# EAGLE schematic SPU (EAGLE 9.6.2), part 2 of 2
## Sheet 8 of 8: STAMP 6
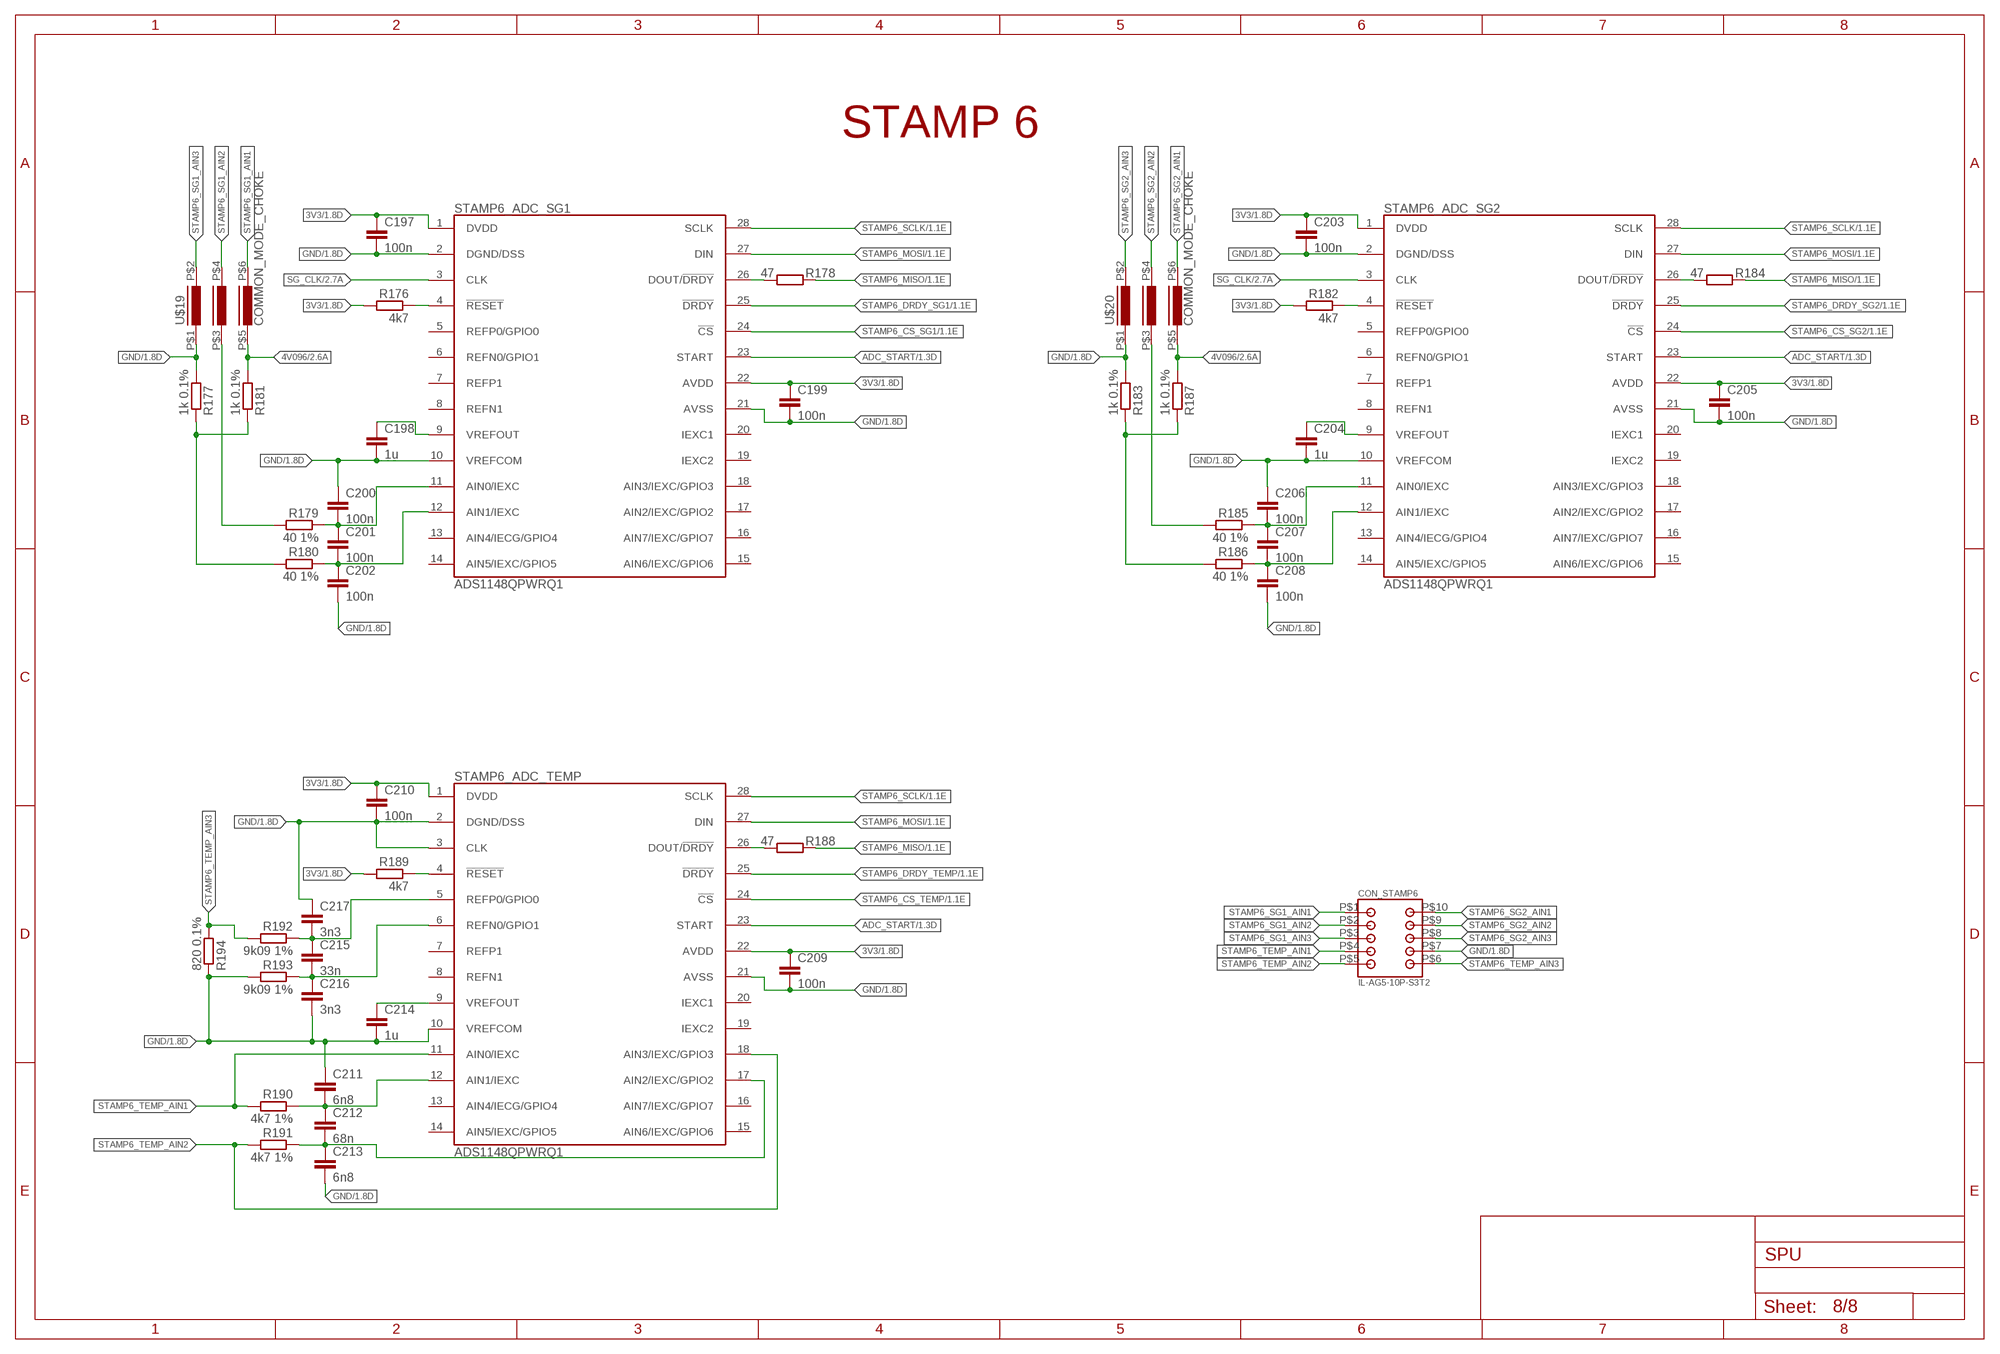
[diagram p7: schematic, sheet 8]

### Parts
C197  100n  C-EUC0805  [C0805]
C198  1u  C-EUC0805  [C0805]
C199  100n  C-EUC0805  [C0805]
C200  100n  C-EUC0805  [C0805]
C201  100n  C-EUC0805  [C0805]
C202  100n  C-EUC0805  [C0805]
C203  100n  C-EUC0805  [C0805]
C204  1u  C-EUC0805  [C0805]
C205  100n  C-EUC0805  [C0805]
C206  100n  C-EUC0805  [C0805]
C207  100n  C-EUC0805  [C0805]
C208  100n  C-EUC0805  [C0805]
C209  100n  C-EUC0805  [C0805]
C210  100n  C-EUC0805  [C0805]
C211  6n8  C-EUC0805  [C0805]
C212  68n  C-EUC0805  [C0805]
C213  6n8  C-EUC0805  [C0805]
C214  1u  C-EUC0805  [C0805]
C215  33n  C-EUC0805  [C0805]
C216  3n3  C-EUC0805  [C0805]
C217  3n3  C-EUC0805  [C0805]
CON_STAMP6  IL-AG5-10P-S3T2  [IL-AG5-10P-S3T2]
R176  4k7  R-EU_R0805  [R0805]
R177  1k 0.1%  R-EU_R0805  [R0805]
R178  47  R-EU_R0805  [R0805]
R179  40 1%  R-EU_R0805  [R0805]
R180  40 1%  R-EU_R0805  [R0805]
R181  1k 0.1%  R-EU_R0805  [R0805]
R182  4k7  R-EU_R0805  [R0805]
R183  1k 0.1%  R-EU_R0805  [R0805]
R184  47  R-EU_R0805  [R0805]
R185  40 1%  R-EU_R0805  [R0805]
R186  40 1%  R-EU_R0805  [R0805]
R187  1k 0.1%  R-EU_R0805  [R0805]
R188  47  R-EU_R0805  [R0805]
R189  4k7  R-EU_R0805  [R0805]
R190  4k7 1%  R-EU_R0805  [R0805]
R191  4k7 1%  R-EU_R0805  [R0805]
R192  9k09 1%  R-EU_R0805  [R0805]
R193  9k09 1%  R-EU_R0805  [R0805]
R194  820 0.1%  R-EU_R0805  [R0805]
STAMP6_ADC_SG1  ADS1148QPWRQ1  [TSSOP28]
STAMP6_ADC_SG2  ADS1148QPWRQ1  [TSSOP28]
STAMP6_ADC_TEMP  ADS1148QPWRQ1  [TSSOP28]
U$19  COMMON_MODE_CHOKE  [COMMON_MODE_CHOKE]
U$20  COMMON_MODE_CHOKE  [COMMON_MODE_CHOKE]

### Nets
3V3: C197.1 C199.1 C203.1 C205.1 C209.1 C210.1 R176.2 R182.2 R189.2 STAMP6_ADC_SG1.1(DVDD) STAMP6_ADC_SG1.22(AVDD) STAMP6_ADC_SG2.1(DVDD) STAMP6_ADC_SG2.22(AVDD) STAMP6_ADC_TEMP.1(DVDD) STAMP6_ADC_TEMP.22(AVDD) ; also sheet 1,2,3,4,5,6,7
4V096: R181.2 R187.2 U$19.P$5 U$20.P$5 ; also sheet 2,3,4,5,6,7
ADC_START: STAMP6_ADC_SG1.23(START) STAMP6_ADC_SG2.23(START) STAMP6_ADC_TEMP.23(START) ; also sheet 1,3,4,5,6,7
GND: C197.2 C198.2 C199.2 C200.1 C202.2 C203.2 C204.2 C205.2 C206.1 C208.2 C209.2 C210.2 C211.1 C213.2 C214.2 C216.2 C217.1 CON_STAMP6.P$7 R177.2 R183.2 R193.2 R194.1 STAMP6_ADC_SG1.2(DGND/DSS) STAMP6_ADC_SG1.10(VREFCOM) STAMP6_ADC_SG1.21(AVSS) STAMP6_ADC_SG2.2(DGND/DSS) STAMP6_ADC_SG2.10(VREFCOM) STAMP6_ADC_SG2.21(AVSS) STAMP6_ADC_TEMP.2(DGND/DSS) STAMP6_ADC_TEMP.3(CLK) STAMP6_ADC_TEMP.10(VREFCOM) STAMP6_ADC_TEMP.21(AVSS) U$19.P$1 U$20.P$1 ; also sheet 1,2,3,4,5,6,7
N$196: R176.1 STAMP6_ADC_SG1.4(!RESET)
N$197: C198.1 STAMP6_ADC_SG1.9(VREFOUT)
N$198: R178.2 STAMP6_ADC_SG1.26(DOUT/!DRDY)
N$199: C200.2 C201.1 R179.1 STAMP6_ADC_SG1.11(AIN0/IEXC)
N$200: C201.2 C202.1 R180.1 STAMP6_ADC_SG1.12(AIN1/IEXC)
N$201: R177.1 R180.2 R181.1
N$202: R179.2 U$19.P$3
N$203: R182.1 STAMP6_ADC_SG2.4(!RESET)
N$204: C204.1 STAMP6_ADC_SG2.9(VREFOUT)
N$205: R184.2 STAMP6_ADC_SG2.26(DOUT/!DRDY)
N$206: C206.2 C207.1 R185.1 STAMP6_ADC_SG2.11(AIN0/IEXC)
N$207: C207.2 C208.1 R186.1 STAMP6_ADC_SG2.12(AIN1/IEXC)
N$208: R183.1 R186.2 R187.1
N$209: R185.2 U$20.P$3
N$210: R188.2 STAMP6_ADC_TEMP.26(DOUT/!DRDY)
N$211: R189.1 STAMP6_ADC_TEMP.4(!RESET)
N$212: C211.2 C212.1 R190.1 STAMP6_ADC_TEMP.12(AIN1/IEXC)
N$213: C212.2 C213.1 R191.1 STAMP6_ADC_TEMP.17(AIN2/IEXC/GPIO2)
N$214: C214.1 STAMP6_ADC_TEMP.9(VREFOUT)
N$215: C215.2 C216.1 R193.1 STAMP6_ADC_TEMP.6(REFN0/GPIO1)
N$216: C215.1 C217.2 R192.1 STAMP6_ADC_TEMP.5(REFP0/GPIO0)
SG_CLK: STAMP6_ADC_SG1.3(CLK) STAMP6_ADC_SG2.3(CLK) ; also sheet 2,3,4,5,6,7
STAMP6_CS_SG1: STAMP6_ADC_SG1.24(!CS) ; also sheet 1
STAMP6_CS_SG2: STAMP6_ADC_SG2.24(!CS) ; also sheet 1
STAMP6_CS_TEMP: STAMP6_ADC_TEMP.24(!CS) ; also sheet 1
STAMP6_DRDY_SG1: STAMP6_ADC_SG1.25(!DRDY) ; also sheet 1
STAMP6_DRDY_SG2: STAMP6_ADC_SG2.25(!DRDY) ; also sheet 1
STAMP6_DRDY_TEMP: STAMP6_ADC_TEMP.25(!DRDY) ; also sheet 1
STAMP6_MISO: R178.1 R184.1 R188.1 ; also sheet 1
STAMP6_MOSI: STAMP6_ADC_SG1.27(DIN) STAMP6_ADC_SG2.27(DIN) STAMP6_ADC_TEMP.27(DIN) ; also sheet 1
STAMP6_SCLK: STAMP6_ADC_SG1.28(SCLK) STAMP6_ADC_SG2.28(SCLK) STAMP6_ADC_TEMP.28(SCLK) ; also sheet 1
STAMP6_SG1_AIN1: CON_STAMP6.P$1 U$19.P$6
STAMP6_SG1_AIN2: CON_STAMP6.P$2 U$19.P$4
STAMP6_SG1_AIN3: CON_STAMP6.P$3 U$19.P$2
STAMP6_SG2_AIN1: CON_STAMP6.P$10 U$20.P$6
STAMP6_SG2_AIN2: CON_STAMP6.P$9 U$20.P$4
STAMP6_SG2_AIN3: CON_STAMP6.P$8 U$20.P$2
STAMP6_TEMP_AIN1: CON_STAMP6.P$4 R190.2 STAMP6_ADC_TEMP.11(AIN0/IEXC)
STAMP6_TEMP_AIN2: CON_STAMP6.P$5 R191.2 STAMP6_ADC_TEMP.18(AIN3/IEXC/GPIO3)
STAMP6_TEMP_AIN3: CON_STAMP6.P$6 R192.2 R194.2
Unconnected: STAMP6_ADC_SG1.5(REFP0/GPIO0) STAMP6_ADC_SG1.6(REFN0/GPIO1) STAMP6_ADC_SG1.7(REFP1) STAMP6_ADC_SG1.8(REFN1) STAMP6_ADC_SG1.13(AIN4/IECG/GPIO4) STAMP6_ADC_SG1.14(AIN5/IEXC/GPIO5) STAMP6_ADC_SG1.15(AIN6/IEXC/GPIO6) STAMP6_ADC_SG1.16(AIN7/IEXC/GPIO7) STAMP6_ADC_SG1.17(AIN2/IEXC/GPIO2) STAMP6_ADC_SG1.18(AIN3/IEXC/GPIO3) STAMP6_ADC_SG1.19(IEXC2) STAMP6_ADC_SG1.20(IEXC1) STAMP6_ADC_SG2.5(REFP0/GPIO0) STAMP6_ADC_SG2.6(REFN0/GPIO1) STAMP6_ADC_SG2.7(REFP1) STAMP6_ADC_SG2.8(REFN1) STAMP6_ADC_SG2.13(AIN4/IECG/GPIO4) STAMP6_ADC_SG2.14(AIN5/IEXC/GPIO5) STAMP6_ADC_SG2.15(AIN6/IEXC/GPIO6) STAMP6_ADC_SG2.16(AIN7/IEXC/GPIO7) STAMP6_ADC_SG2.17(AIN2/IEXC/GPIO2) STAMP6_ADC_SG2.18(AIN3/IEXC/GPIO3) STAMP6_ADC_SG2.19(IEXC2) STAMP6_ADC_SG2.20(IEXC1) STAMP6_ADC_TEMP.7(REFP1) STAMP6_ADC_TEMP.8(REFN1) STAMP6_ADC_TEMP.13(AIN4/IECG/GPIO4) STAMP6_ADC_TEMP.14(AIN5/IEXC/GPIO5) STAMP6_ADC_TEMP.15(AIN6/IEXC/GPIO6) STAMP6_ADC_TEMP.16(AIN7/IEXC/GPIO7) STAMP6_ADC_TEMP.19(IEXC2) STAMP6_ADC_TEMP.20(IEXC1)

### Notes on the sheet
- STAMP 6

## Library data of the parts
C1-C37 C42-C59 C63 C68-C71 C73-C79 C92-C175 C197-C217 = rcl:C-EU: CAPACITOR, European symbol; SPICEPREFIX: C
C38-C41 C60-C62 C64-C67 = rcl:CPOL-EU: POLARIZED CAPACITOR, European symbol; SPICEPREFIX: C
CON_STAMP1-CON_STAMP6 = con-jae:IL-AG5-10P-S3T2
D1 D5 = diodes:DZ: Zener diode
FL MS MSS PWR RC = adafruit:LED: LED OSRAM: - CHIPLED LG R971, LG N971, LY N971, LG Q971, LY Q971, LO R971, LY R971 LH N974, LH R974 LS Q976, LO Q976, LY Q976 LO Q996 - Hyper CHIPLED LW Q18S LB Q993, LB Q99A, LB R99A - SideLED LS A670, LO A670, LY A670, LG A670, LP A670 LB A673, LV A673, LT A673, LW A673 LH A674 LY A675 LS A676, LA A676, LO A676, LY A676, LW A676 LS A679, LY A679, LG A679 - Hyper Micro SIDELED® LS Y876, LA Y876, LO Y876, LY Y876 LT Y87S - SmartLED LW L88C, LW L88S LB L89C, LB L89S, LG L890 LS L89K, LO L89K, LY L89K LS L896, LA L896, LO L896, LY L896 - TOPLED LS T670, LO T670, LY T670, LG T670, LP T670 LSG T670, LSP T670, LSY T670, LOP T670, LYG T670 LG T671, LOG T671, LSG T671 LB T673, LV T673, LT T673, LW T673 LH T674 LS T676, LA T676, LO T676, LY T676, LB T676, LH T676, LSB T676, LW T676 LB T67C, LV T67C, LT T67C, LS T67K, LO T67K, LY T67K, LW E67C LS E67B, LA E67B, LO E67B, LY E67B, LB E67C, LV E67C, LT E67C LW T67C LS T679, LY T679, LG T679 LS T770, LO T770, LY T770, LG T770, LP T770 LB T773, LV T773, LT T773, LW T773 LH T774 LS E675, LA E675, LY E675, LS T675 LS T776, LA T776, LO T776, LY T776, LB T776 LHGB T686 LT T68C, LB T68C - Hyper Mini TOPLED® LB M676 - Mini TOPLED Santana® LG M470 LS M47K, LO M47K, LY M47K Source: http://www.osram.convergy.de/
FT_EEPROM = smf2:M93C46-WDW6TP: EEPORM M93C46 - WDW6TP Hersteller: STMicroelectronics Datenblatt <https://www.mouser.de/datasheet/2/389/cd00001142-1795513.pdf>
L1 L2 = rcl:L-EU: INDUCTOR, European symbol; SPICEPREFIX: L
PROBES = selfmade:PSS254_G3
Q1 Q3-Q6 = transistor-small-signal:BSS123: N-CHANNEL MOS FET
Q2 = adafruit:CRYSTAL: CRYSTAL; OC_FARNELL: unknown; OC_NEWARK: unknown
R1-R4 R9 R14 R24-R33 R35 R36 R40-R42 R45 R46 R50 R51 R54-R57 R60 R61 R68-R156 R176-R194 = rcl:R-EU_: RESISTOR, European symbol; SPICEPREFIX: R
R10-R13 R15-R23 R34 R43 R44 R47-R49 R52 R53 = rcl:R-EU_: RESISTOR, European symbol
RCJ1 RCJ2 Y1J1 Y1J2 = jumper:SJ: SMD solder JUMPER
REF4V096 = selfmade:LM4030
S70FL = smf2:S70FL01GSAGM: Memory S70FL01G Datenblatt <https://www.cypress.com/file/233721/download>
SF2_M2S010TQ1 = smf2:SF2_M2S010TQ144: Smart Fusion SoC Dokumente <https://www.microsemi.com/product-directory/soc-fpgas/1692-smartfusion2#documentation> Pin Out TQ144 <https://www.microsemi.com/document-portal/doc_download/133134-smartfusion2-tq144-pinouts>
STAMP1_ADC_SG1 STAMP1_ADC_SG2 STAMP1_ADC_TEMP STAMP2_ADC_SG1 STAMP2_ADC_SG2 STAMP2_ADC_TEMP STAMP3_ADC_SG1 STAMP3_ADC_SG2 STAMP3_ADC_TEMP STAMP4_ADC_SG1 STAMP4_ADC_SG2 STAMP4_ADC_TEMP STAMP5_ADC_SG1 STAMP5_ADC_SG2 STAMP5_ADC_TEMP STAMP6_ADC_SG1 STAMP6_ADC_SG2 STAMP6_ADC_TEMP = ads11xx:ADS1148QPWRQ1
TPS78512QKVURQ1 = selfmade:TPS785
U$1-U$3 = selfmade:NXB0108PWJ
U$5 = selfmade:DSC1001CI1-004.0960T; SPICEPREFIX: E
U$6 U$7 U$9-U$16 U$19 U$20 = selfmade:COMMON_MODE_CHOKE: WE-SL3 SMT COMMON MODE LINE FILT
U_7805 = m-pad-2.1:LM78L05ACMX/NOPB
U_LT1528 = aSparkFun:LT1528: LT1528 High current voltage regulator commonly used with GM862 cellular module. Spark Fun Electronics SKU : COM-00311. Footprint may need to have the large paste aperature reduced.
U_MAX488 = maxim:MAX488: RS485 TRANSEIVER Source: Data sheet <http://datasheets.maxim-ic.com/en/ds/MAX1487-MAX491.pdf>; MF: MAXIM; MPN: MAX488CSA; OC_FARNELL: 3534170; OC_NEWARK: 34C3921
U_OPTO_3-U_OPTO_5 = Opto-Electronic:MOCD207M: 8- pin SOIC Dual-Channel Phototransistor Output Optocoupler; CATEGORY: Opto-Electronic; MANUFACTURER: ON Semiconductor; MPN: MOCD207M; OPERTAING_TEMP: -40 to +100 °C; PART_STATUS: Active; ROHS_COMPLIANT: RoHS3 Compliant; SUB-CATEGORY: OptoCoupler; THERMALLOSS: 0.24W
U_TRACODCDC = traco_thl_tel_series:THL_20WI_SERIES: TRACO POWER DC/DC converter THL 20WI Series created by Mario Blunk - electronics & IT engineering at www.train-z.de; HEAT-SINK: NO
USB = smf2:FT2232HL: FTDI FT2232HL Datenblatt <https://ftdichip.com/wp-content/uploads/2020/07/DS_FT2232H.pdf>
USB_CONN = adafruit:USB: USB Connectors USBMINIB - Surface Mount Female Mini-B USB Connector 4UConnector: 06564 By microbuilder.eu Thru-hole RA Female Mini-B USB Connector 4UConnector: 18732 By ladyada.net
WP = selfmade:PSS254_G2
X1 = con-subd:M15: SUB-D; OC_FARNELL: unknown; OC_NEWARK: unknown
Y1 = Eagle_WE-XTAL (rev21c):WE-XTAL_IQXC-90: WE-XTAL Watch Crystals Characteristics SMT and THT models Hermetically sealed Frequency: 32.768 kHz Tolerances down to ±10 ppm available Characteristics Microprocessor Real Time Clocks Test and Measurement Equipment Battery powered Applications <https://www.we-online.com/catalog/media/o162740v209%20Family_WE-XTAL_WatchCrystal.jpg> Details see: https://www.we-online.com/catalog/en/WE-XTAL_WATCHCRYSTAL Updated by Ella Wu, 2020-10-30 2020 (C) Wurth Elektronik; C-LOAD: 6pF; DATASHEET-URL: https://www.we-online.com/catalog/datasheet/830107088501.pdf; MOUNT: SMT; PART-NUMBER: 830107088501; TOLERANCE: ±20ppm
ZE05H-4P-2V = con-hirose:ZE05-4P-2V

## Net classes
0 default: width 0.254 mm, drill 0.203 mm, clearance 0.178 mm
1 28V: width 0.381 mm, drill 0.203 mm, clearance 0.635 mm
2 5v: width 0.635 mm, drill 0.203 mm, clearance 0.254 mm
3 28vClearExcept: width 0.635 mm, drill 0.203 mm, clearance 0.508 mm to class 1, clearance 0.178 mm